# Altium schematic sheet Misc Sensors-Encoding.SchDoc
size A
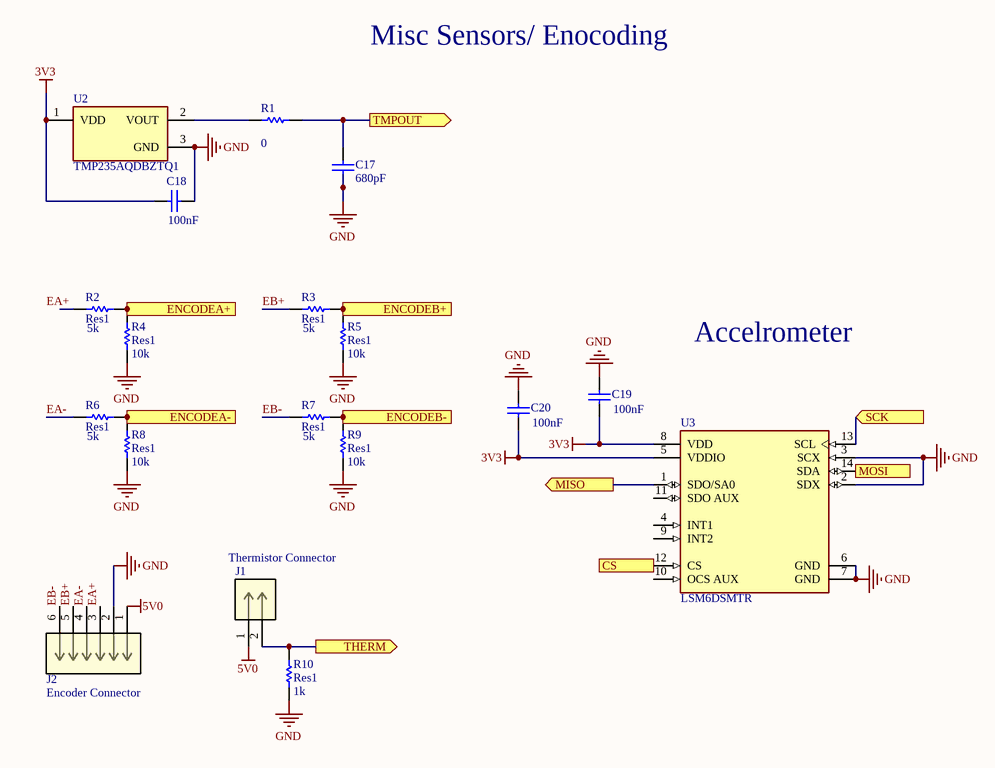
[diagram p0: Misc Sensors-Encoding.SchDoc]

## Parts
C17  value 680pF  [1608[0603]]  (hidden comment: Cap)
C18  value 100nF  [1608[0603]]  (hidden comment: Cap)
C19  value 100nF  [1608[0603]]  (hidden comment: Cap)
C20  value 100nF  [1608[0603]]  (hidden comment: Cap)
J1  Thermistor Connector  [CONN_B2B-EH-A (LF)(SN)_JST]
J2  Encoder Connector  [CONN_B6B-XH-A(LF)(SN)_JST]
R1  value 0  [0402-A]  (hidden comment: Res1)
R2  Res1  value 5k  [0402-A]
R3  Res1  value 5k  [0402-A]
R4  Res1  value 10k  [0402-A]
R5  Res1  value 10k  [0402-A]
R6  Res1  value 5k  [0402-A]
R7  Res1  value 5k  [0402-A]
R8  Res1  value 10k  [0402-A]
R9  Res1  value 10k  [0402-A]
R10  Res1  value 1k  [0402-A]
U2  TMP235AQDBZTQ1  [FP-DBZ0003A-MFG]
U3  LSM6DSMTR  [FP-LGA-14L-DM00249496-MFG]

## Ports
CS (in), ENCODEA+ (out), ENCODEA- (out), ENCODEB+ (out), ENCODEB- (out), MISO (out), MOSI (in), SCK (in), THERM (out), TMPOUT (out)

## Nets
3V3: C18.1 C19.2 C20.2 U2.1(VDD) U3.5(VDDIO) U3.8(VDD)
5V0: J1.1 J2.1
GND: C17.2 C18.2 C19.1 C20.1 J2.2 R4.2 R5.2 R8.2 R9.2 R10.2 U2.3(GND) U3.2(SDX) U3.3(SCX) U3.6(GND) U3.7(GND)
CS: U3.12(CS) ; port CS
EA+: J2.3
EA-: J2.4 R6.2
EB+: J2.5 R3.2
EB-: J2.6 R7.2
ENCODEA+: R2.1 R4.1 ; port ENCODEA+
ENCODEA-: R6.1 R8.1 ; port ENCODEA-
ENCODEB+: R3.1 R5.1 ; port ENCODEB+
ENCODEB-: R7.1 R9.1 ; port ENCODEB-
MISO: U3.1(SDO/SA0) ; port MISO
MOSI: U3.14(SDA) ; port MOSI
SCK: U3.13(SCL) ; port SCK
THERM: J1.2 R10.1 ; port THERM
TMPOUT: C17.1 R1.2 ; port TMPOUT
NetR1_1: R1.1 U2.2(VOUT)

Not connected (* = marked no-connect by the designer): R2 2; U3 4(INT1) 9(INT2) 10(OCS_AUX) 11(SDO_AUX)

## Notes on the sheet
- Misc Sensors/ Enocoding
- Accelrometer
- Labels drawn without touching a wire or pin: EA+

## Library data of the parts
C17-C20 = Cap: Capacitor; Published: 8-Jun-2000; LatestRevisionDate: 17-Jul-2002; LatestRevisionNote: Re-released for DXP Platform.; PackageReference: RAD-0.3; Publisher: Altium Limited; PackageDescription: Radial Cap, Thru-Hole; 2 Leads; 0.3 in Pin Spacing
J1 = B2B-EH-A (LF)(SN): No Description Available; Vendor: JST; Built_By: EMA_TJ; SourceLibrary: JST_2019-01-31; Copyright: Copyright (C) 2018 Accelerated Designs. All rights reserved; Manufacturer_Part_Number: B2B-EH-A (LF)(SN); RefDes: RefDes; Type: DEV
J2 = B6B-XH-A(LF)(SN): No Description Available; Vendor: JST; Built_By: EMA_Cory; SourceLibrary: JST_2019-12-02; Manufacturer_Part_Number: B6B-XH-A(LF)(SN); Copyright: Copyright (C) 2018 Accelerated Designs. All rights reserved; RefDes: RefDes; Type: DEV
R1-R10 = Res1: Resistor; Published: 8-Jun-2000; LatestRevisionDate: 17-Jul-2002; LatestRevisionNote: Re-released for DXP Platform.; PackageReference: AXIAL-0.3; Publisher: Altium Limited; PackageDescription: Axial Device, Thru-Hole; 2 Leads; 0.3 in Pin Spacing
U2 = CMP-04948-000003-1: LOW-POWER HIGH-ACCURACY ANALOG O; Manufacturer: Texas Instruments; Manufacturer Part Number: TMP235A2DBZR; Output Current: 500uA; Operating Supply Current: 9uA; Max Supply Voltage: 5.5V; Max Junction Temp: +150°C; Accuracy: 0.5%; Min Supply Voltage: 2.3V; Standoff Height: 0.01mm; Sensor Output: Analog Voltage; Ambient Temperature Range Low: -40°C; Device Class L2: Temperature and Humidity Sensors; Digikey Description: LOW-POWER HIGH-ACCURACY ANALOG O; Lead Free: Yes; Category: IC; Device Class L3: unset; Temperature Range Low: -40°C; ComponentLink2Description: Datasheet; Package: DBZ0003A; Octopart: https://octopart.com/tmp235a2dbzr-texas+instruments-94966376; Device Class L1: Sensors; Temperature Range High: +150°C; Height: 1.12mm; Temperature: -40°C to +150°C; RoHS: TRUE; Ambient Temperature Range High: +150°C; Automotive: No; ComponentLink2URL: http://www.ti.com/lit/ds/symlink/tmp235.pdf; Mouser Description: ±2°C Analog output temperature sensor, with 10mV /°C gain 3-SOT-23 -40 to 150
U3 = CMP-12177-000008-1: IMU ACCEL/GYRO I2C/SPI 14LGA; Manufacturer: STMicroelectronics; Operating Supply Current: 0.29-0.65mA; Gyro Range: 125/250/500/1000/2000°/s; Sensor Output: I2C,SPI; Accel Range: 2/4/8/16g; Min Supply Voltage: 1.62V; Resolution: 16bits; Sensor Type: Temperature,Accelerometer,Gyroscope; Max Supply Voltage: 3.6V; Manufacturer Part Number: LSM6DSMTR; Octopart: https://octopart.com/lsm6dsmtr-stmicroelectronics-66358194; Height: 0.86mm; Category: IC; Lead Free: Yes; Temperature: -40°C to +85°C; Temperature Range Low: -40°C; ComponentLink2Description: Datasheet; ComponentLink2URL: https://www.st.com/resource/en/datasheet/lsm6dsm.pdf; Digikey Description: IMU ACCEL/GYRO I2C/SPI 14LGA; Footprint Url: https://www.st.com/content/ccc/resource/technical/document/technical_note/73/17/9c/16/dd/96/4a/01/CD00134799.pdf/files/CD00134799.pdf/jcr:content/translations/en.CD00134799.pdf; Device Class L1: Sensors; Device Class L2: Motion Sensors; Temperature Range High: +85°C; Mouser Description: LSM6DSM Series 3.6 V I2C/SPI 3D Accelerometer and 3D Gyroscope - LGA-14; Device Class L3: Inertial Measurement Units (IMUs); Automotive: No; Package: LGA-14L-DM00249496; RoHS: TRUE